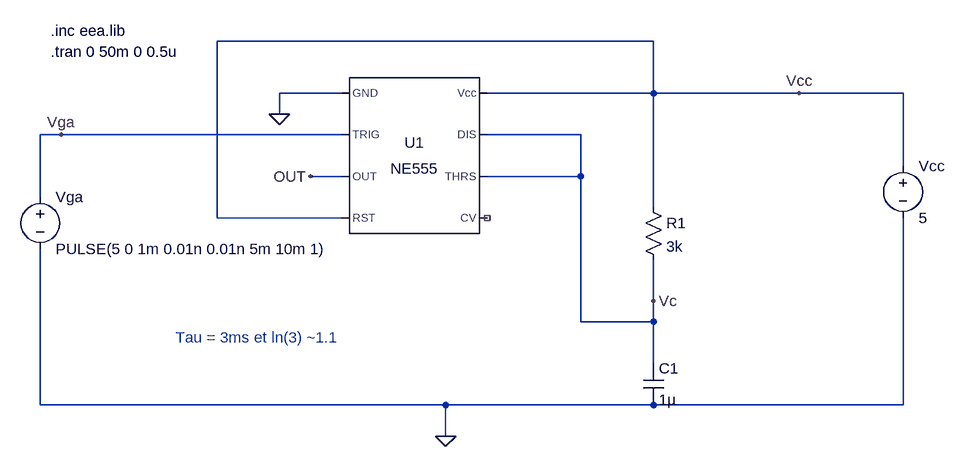
[diagram p0: schematic STI_TC1_Auto_4-NE55-2.asc]
STI_TC1_Auto_4-NE55-2.asc, the LTspice schematic file:
Version 4
SHEET 1 1012 680
WIRE 560 32 -112 32
WIRE 80 112 -16 112
WIRE 560 112 560 32
WIRE 560 112 304 112
WIRE 784 112 560 112
WIRE 944 112 784 112
WIRE -16 144 -16 112
WIRE -352 176 -384 176
WIRE 80 176 -352 176
WIRE 448 176 304 176
WIRE 944 224 944 112
WIRE 80 240 32 240
WIRE 448 240 448 176
WIRE 448 240 304 240
WIRE -384 272 -384 176
WIRE 560 288 560 112
WIRE -112 304 -112 32
WIRE 80 304 -112 304
WIRE 560 432 560 368
WIRE 448 464 448 240
WIRE 560 464 560 432
WIRE 560 464 448 464
WIRE 560 528 560 464
WIRE -384 592 -384 352
WIRE 240 592 -384 592
WIRE 560 592 240 592
WIRE 944 592 944 304
WIRE 944 592 560 592
WIRE 240 640 240 592
FLAG 32 240 OUT
FLAG -16 144 0
FLAG 784 112 Vcc
FLAG 560 432 Vc
FLAG -352 176 Vga
FLAG 240 640 0
SYMBOL Misc\\NE555 192 208 R0
SYMATTR InstName U1
SYMBOL voltage 944 208 R0
SYMATTR InstName Vcc
SYMATTR Value 5
SYMBOL voltage -384 256 R0
WINDOW 123 0 0 Left 0
WINDOW 39 0 0 Left 0
SYMATTR InstName Vga
SYMATTR Value PULSE(5 0 1m 0.01n 0.01n 5m 10m 1)
SYMBOL cap 544 528 R0
SYMATTR InstName C1
SYMATTR Value 1µ
SYMBOL res 544 272 R0
SYMATTR InstName R1
SYMATTR Value 3k
TEXT -368 48 Left 2 !.tran 0 50m 0 0.5u
TEXT -368 16 Left 2 !.inc eea.lib
TEXT -176 488 Left 2 ;Tau = 3ms et ln(3) ~1.1

The netlist it stands for:
* STI_TC1_Auto_4-NE55-2.asc
XU1 0 Vga OUT Vcc NC_01 Vc Vc Vcc NE555  ; pins GND TRIG OUT RST CV THRS DIS Vcc
Vcc Vcc 0 5
Vga Vga 0 PULSE(5 0 1m 0.01n 0.01n 5m 10m 1)
C1 Vc 0 1µ
R1 Vcc Vc 3k
.tran 0 50m 0 0.5u
.inc eea.lib
* Tau = 3ms et ln(3) ~1.1
.lib NE555.sub
.backanno
.end

* Results of the author's LTspice run, read from the files saved beside the schematic
* Operating Point, zero values left out:
*   V(vga) = 5 V
*   V(vcc) = 5 V
*   V(vc) = 5 V
*   V(out) = 5 V
*   I(R1) = 11.67 nA
*   I(Vga) = -5 nA
*   I(Vcc) = -1.611 mA
*   Ix(u1:1) = -1.611 mA
*   Ix(u1:2) = 5 nA
*   Ix(u1:4) = 22.67 µA
*   Ix(u1:6) = 5 nA
*   Ix(u1:7) = 6.672 nA
*   Ix(u1:8) = 1.588 mA
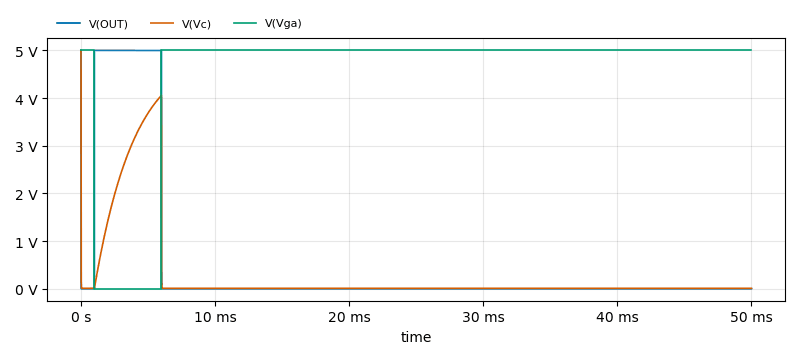
[diagram p1: Transient Analysis of STI_TC1_Auto_4-NE55-2.asc, plotted from the saved traces]
* Transient Analysis, 1 run:
*   V(OUT): min 30 µV, max 5 V, average 500 mV, rms 1.581 V, last 30 µV
*   V(Vc): min 9.98 mV, max 5 V, average 267.1 mV, rms 891.5 mV, last 9.98 mV
*   V(Vga): min 0 V, max 5 V, average 4.5 V, rms 4.743 V, last 5 V